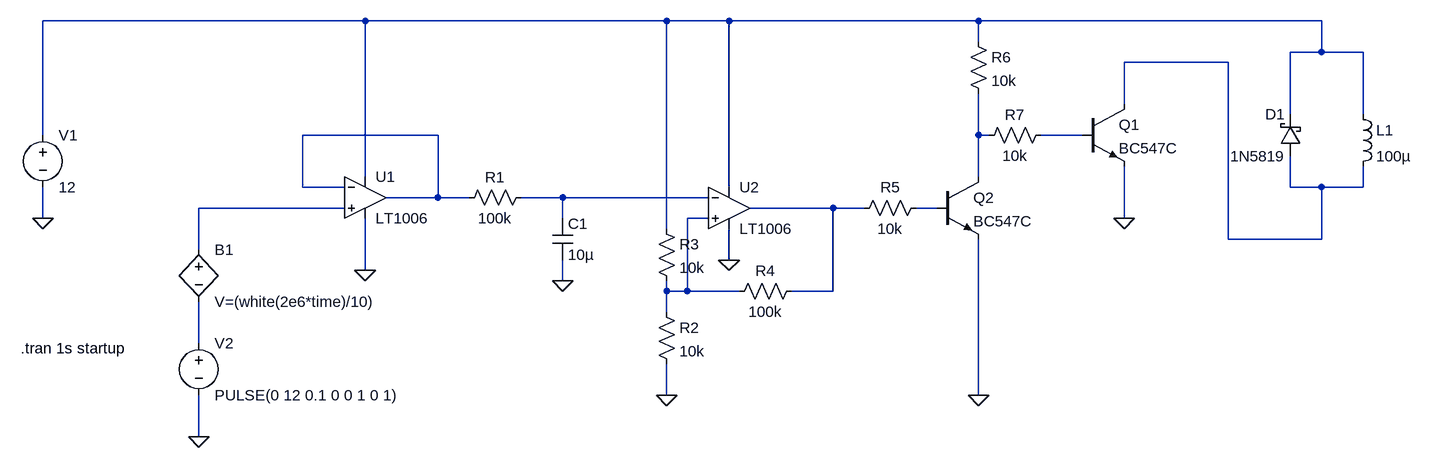
[diagram p0: schematic 2022_05_13_opamp_schmitt_trigger_lowpass.asc]
2022_05_13_opamp_schmitt_trigger_lowpass.asc, the LTspice schematic file:
Version 4
SHEET 1 1844 680
WIRE 192 -96 -304 -96
WIRE 656 -96 192 -96
WIRE 752 -96 656 -96
WIRE 1136 -96 752 -96
WIRE 1664 -96 1136 -96
WIRE 1136 -64 1136 -96
WIRE 1664 -48 1664 -96
WIRE 1664 -48 1616 -48
WIRE 1728 -48 1664 -48
WIRE 1520 -32 1360 -32
WIRE 1360 32 1360 -32
WIRE 1616 48 1616 -48
WIRE 1728 48 1728 -48
WIRE -304 80 -304 -96
WIRE 304 80 96 80
WIRE 1136 80 1136 16
WIRE 1152 80 1136 80
WIRE 1296 80 1232 80
WIRE 192 144 192 -96
WIRE 1136 144 1136 80
WIRE 96 160 96 80
WIRE 160 160 96 160
WIRE 752 160 752 -96
WIRE 1616 160 1616 112
WIRE 1664 160 1616 160
WIRE 1728 160 1728 128
WIRE 1728 160 1664 160
WIRE 304 176 304 80
WIRE 304 176 224 176
WIRE 352 176 304 176
WIRE 496 176 432 176
WIRE 720 176 496 176
WIRE 160 192 -64 192
WIRE 912 192 784 192
WIRE 960 192 912 192
WIRE 1072 192 1040 192
WIRE -304 208 -304 160
WIRE 496 208 496 176
WIRE 720 208 688 208
WIRE 1360 208 1360 128
WIRE 656 224 656 -96
WIRE 1520 240 1520 -32
WIRE 1664 240 1664 160
WIRE 1664 240 1520 240
WIRE -64 256 -64 192
WIRE 752 272 752 224
WIRE 192 288 192 208
WIRE 496 304 496 272
WIRE 656 320 656 304
WIRE 688 320 688 208
WIRE 688 320 656 320
WIRE 768 320 688 320
WIRE 912 320 912 192
WIRE 912 320 848 320
WIRE 656 352 656 320
WIRE -64 400 -64 336
WIRE 656 480 656 432
WIRE 1136 480 1136 240
WIRE -64 544 -64 480
FLAG 192 288 0
FLAG -304 208 0
FLAG -64 544 0
FLAG 496 304 0
FLAG 752 272 0
FLAG 656 480 0
FLAG 1136 480 0
FLAG 1360 208 0
SYMBOL voltage -304 64 R0
WINDOW 123 0 0 Left 0
WINDOW 39 0 0 Left 0
SYMATTR InstName V1
SYMATTR Value 12
SYMBOL voltage -64 384 R0
WINDOW 123 0 0 Left 0
WINDOW 39 0 0 Left 0
SYMATTR InstName V2
SYMATTR Value PULSE(0 12 0.1 0 0 1 0 1)
SYMBOL cap 480 208 R0
SYMATTR InstName C1
SYMATTR Value 10µ
SYMBOL res 448 160 R90
WINDOW 0 0 56 VBottom 2
WINDOW 3 32 56 VTop 2
SYMATTR InstName R1
SYMATTR Value 100k
SYMBOL res 640 336 R0
SYMATTR InstName R2
SYMATTR Value 10k
SYMBOL res 640 208 R0
SYMATTR InstName R3
SYMATTR Value 10k
SYMBOL res 864 304 R90
WINDOW 0 0 56 VBottom 2
WINDOW 3 32 56 VTop 2
SYMATTR InstName R4
SYMATTR Value 100k
SYMBOL OpAmps\\LT1006 192 112 R0
SYMATTR InstName U1
SYMBOL OpAmps\\LT1006 752 128 R0
SYMATTR InstName U2
SYMBOL ind 1712 32 R0
SYMATTR InstName L1
SYMATTR Value 100µ
SYMATTR SpiceLine Rser=100
SYMBOL schottky 1632 112 R180
WINDOW 0 24 64 Left 2
WINDOW 3 24 0 Left 2
SYMATTR InstName D1
SYMATTR Value 1N5819
SYMATTR Description Diode
SYMATTR Type diode
SYMBOL npn 1072 144 R0
SYMATTR InstName Q2
SYMATTR Value BC547C
SYMBOL res 1056 176 R90
WINDOW 0 0 56 VBottom 2
WINDOW 3 32 56 VTop 2
SYMATTR InstName R5
SYMATTR Value 10k
SYMBOL res 1120 -80 R0
SYMATTR InstName R6
SYMATTR Value 10k
SYMBOL res 1248 64 R90
WINDOW 0 0 56 VBottom 2
WINDOW 3 32 56 VTop 2
SYMATTR InstName R7
SYMATTR Value 10k
SYMBOL npn 1296 32 R0
SYMATTR InstName Q1
SYMATTR Value BC547C
SYMBOL bv -64 240 R0
SYMATTR InstName B1
SYMATTR Value V=(white(2e6*time)/10)
TEXT -338 408 Left 2 !.tran 1s startup

The netlist it stands for:
* 2022_05_13_opamp_schmitt_trigger_lowpass.asc
V1 N001 0 12
V2 N011 0 PULSE(0 12 0.1 0 0 1 0 1)
C1 N006 0 10µ
R1 N006 N003 100k
R2 N010 0 10k
R3 N001 N010 10k
R4 N008 N010 100k
XU1 N007 N003 N001 0 N003 LT1006  ; pins In+ In- V+ V- OUT
XU2 N010 N006 N001 0 N008 LT1006  ; pins In+ In- V+ V- OUT
L1 N001 N002 100µ Rser=100
D1 N002 N001 1N5819
Q2 N004 N009 0 0 BC547C
R5 N009 N008 10k
R6 N001 N004 10k
R7 N005 N004 10k
Q1 N002 N005 0 0 BC547C
B1 N007 N011 V=(white(2e6*time)/10)
.model D D
.lib standard.dio
.model NPN NPN
.model PNP PNP
.lib standard.bjt
.tran 1s startup
.lib LTC.lib
.backanno
.end